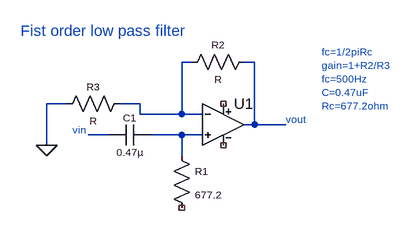
[diagram p0: schematic low pass first order.asc]
low pass first order.asc, the LTspice schematic file:
Version 4
SHEET 1 880 680
WIRE 144 64 128 64
WIRE 240 64 224 64
WIRE -48 128 -80 128
WIRE 64 128 32 128
WIRE 64 144 64 128
WIRE 128 144 128 64
WIRE 128 144 64 144
WIRE 160 144 128 144
WIRE 240 160 240 64
WIRE 240 160 224 160
WIRE 288 160 240 160
WIRE 16 176 -16 176
WIRE 128 176 80 176
WIRE 160 176 128 176
WIRE -80 192 -80 128
WIRE 128 208 128 176
FLAG -80 192 0
SYMBOL cap 80 160 R90
WINDOW 0 0 32 VBottom 1
WINDOW 3 32 32 VTop 1
SYMATTR InstName C1
SYMATTR Value 0.47µ
SYMBOL res 112 192 R0
WINDOW 0 36 40 Left 1
WINDOW 3 36 76 Left 1
SYMATTR InstName R1
SYMATTR Value 677.2
SYMBOL res 240 48 R90
WINDOW 0 0 56 VBottom 1
WINDOW 3 32 56 VTop 1
SYMATTR InstName R2
SYMBOL res -64 144 R270
WINDOW 0 32 56 VTop 1
WINDOW 3 0 56 VBottom 1
SYMATTR InstName R3
SYMBOL TL074 192 160 R0
SYMATTR InstName U1
TEXT -40 168 Left 1 ;vin
TEXT 288 152 Left 1 ;vout
TEXT -120 16 Left 2 ;Fist order low pass filter
TEXT 344 48 Left 1 ;fc=1/2piRc\ngain=1+R2/R3\nfc=500Hz\nC=0.47uF\nRc=677.2ohm

The netlist it stands for:
* low pass first order.asc
C1 N004 N003 0.47µ
R1 N004 NC_01 677.2
R2 N002 N001 R
R3 0 N001 R
XU1 N004 N001 NC_02 NC_03 N002 TL074  ; pins In+ In- V+ V- OUT
* vin
* vout
* Fist order low pass filter
* fc=1/2piRc
* gain=1+R2/R3
* fc=500Hz
* C=0.47uF
* Rc=677.2ohm
.lib C:\Users\thusa.THUSA\Downloads\sloj068\TL074.301
.backanno
.end